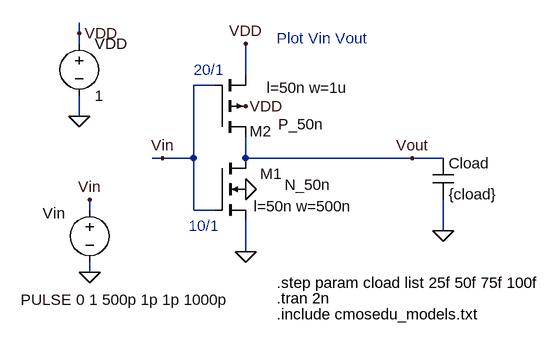
[diagram p0: schematic Fig11_11_varying_load.asc]
Fig11_11_varying_load.asc, the LTspice schematic file:
Version 4
SHEET 1 1136 680
WIRE 192 -368 192 -384
WIRE 192 -352 192 -368
WIRE 448 -304 448 -352
WIRE 400 -288 368 -288
WIRE 192 -240 192 -272
WIRE 320 -176 304 -176
WIRE 368 -176 368 -288
WIRE 368 -176 320 -176
WIRE 448 -176 448 -208
WIRE 704 -176 448 -176
WIRE 752 -176 704 -176
WIRE 208 -96 208 -112
WIRE 368 -96 368 -176
WIRE 400 -96 368 -96
WIRE 752 -64 752 -112
WIRE 448 -32 448 -80
WIRE 208 0 208 -16
FLAG 208 0 0
FLAG 704 -176 Vout
FLAG 208 -112 Vin
FLAG 448 -128 0
FLAG 192 -240 0
FLAG 192 -368 VDD
FLAG 448 -256 VDD
FLAG 448 -32 0
FLAG 448 -352 VDD
FLAG 320 -176 Vin
FLAG 752 -64 0
SYMBOL nmos4 400 -176 R0
WINDOW 0 104 24 Right 2
WINDOW 3 179 41 Right 2
WINDOW 123 213 74 Right 2
SYMATTR InstName M1
SYMATTR Value N_50n
SYMATTR Value2 l=50n w=500n
SYMBOL voltage 208 -112 R0
WINDOW 0 -72 21 Left 2
WINDOW 3 -106 154 Left 2
WINDOW 123 0 0 Left 2
WINDOW 39 0 0 Left 2
SYMATTR InstName Vin
SYMATTR Value PULSE 0 1 500p 1p 1p 1000p
SYMBOL voltage 192 -368 R0
WINDOW 123 0 0 Left 2
WINDOW 39 0 0 Left 2
SYMATTR InstName VDD
SYMATTR Value 1
SYMBOL pmos4 400 -208 M180
WINDOW 0 88 9 Right 2
WINDOW 3 168 20 Right 2
WINDOW 123 206 76 Right 2
SYMATTR InstName M2
SYMATTR Value P_50n
SYMATTR Value2 l=50n w=1u
SYMBOL cap 736 -176 R0
SYMATTR InstName Cload
SYMATTR Value {cload}
TEXT 496 40 Left 2 !.tran 2n
TEXT 496 64 Left 2 !.include cmosedu_models.txt
TEXT 496 -360 Left 2 ;Plot Vin Vout
TEXT 368 -312 Left 2 ;20/1
TEXT 360 -72 Left 2 ;10/1
TEXT 496 16 Left 2 !.step param cload list 25f 50f 75f 100f

The netlist it stands for:
* Fig11_11_varying_load.asc
M1 Vout Vin 0 0 N_50n l=50n w=500n
Vin Vin 0 PULSE 0 1 500p 1p 1p 1000p
VDD VDD 0 1
M2 Vout Vin VDD VDD P_50n l=50n w=1u
Cload Vout 0 {cload}
.model NMOS NMOS
.model PMOS PMOS
.lib standard.mos
.tran 2n
.include cmosedu_models.txt
* Plot Vin Vout
* 20/1
* 10/1
.step param cload list 25f 50f 75f 100f
.backanno
.end